# Altium schematic sheet schematic.SchDoc
size A4; SheetNumber: 1; SheetTotal: 5
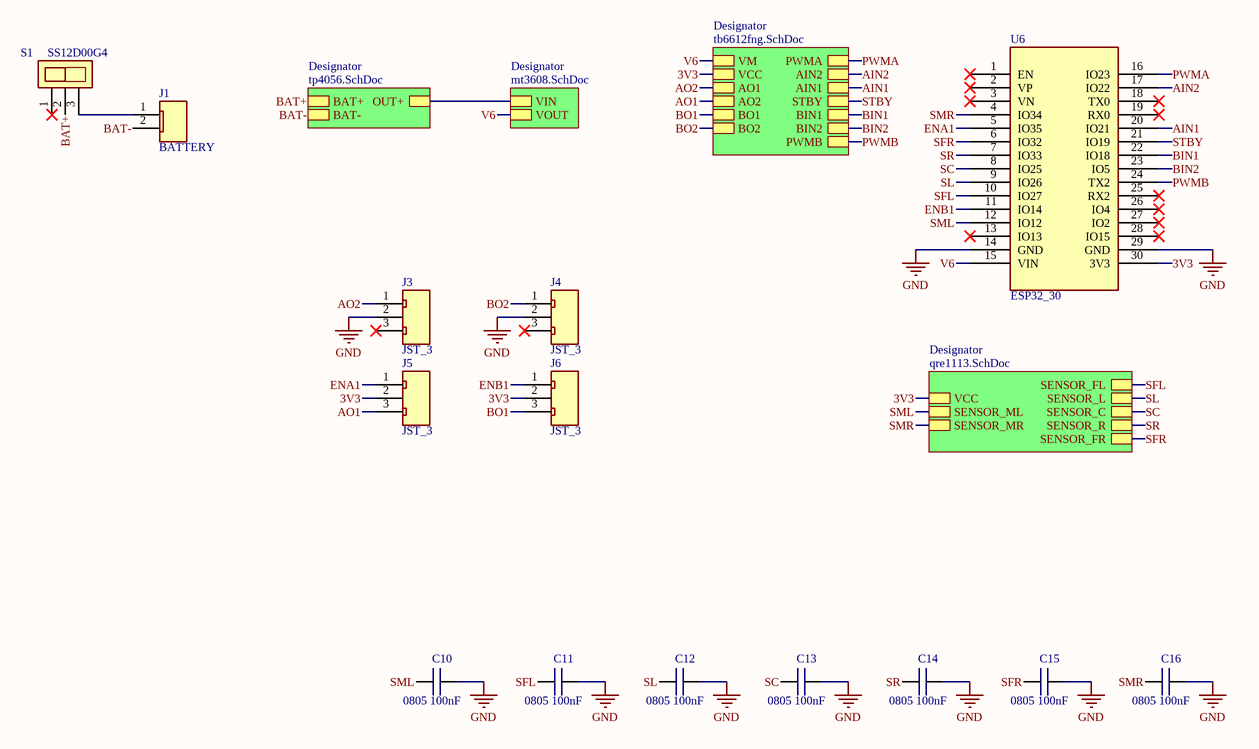
[diagram p0: schematic.SchDoc]

## Parts
C10  0805 100nF  [CAPACITOR 0805]
C11  0805 100nF  [CAPACITOR 0805]
C12  0805 100nF  [CAPACITOR 0805]
C13  0805 100nF  [CAPACITOR 0805]
C14  0805 100nF  [CAPACITOR 0805]
C15  0805 100nF  [CAPACITOR 0805]
C16  0805 100nF  [CAPACITOR 0805]
J1  BATTERY  [JST_2]
J3  JST_3  [JST_3]
J4  JST_3  [JST_3]
J5  JST_3  [JST_3]
J6  JST_3  [JST_3]
S1  SS12D00G4  [SS12D00G4]
U6  ESP32_30  [ESP32_30]

## Sub-sheets
Designator = mt3608.SchDoc: VIN, VOUT
Designator = tp4056.SchDoc: BAT+, OUT+, BAT-
Designator = tb6612fng.SchDoc: VM, VCC, AO1, AO2, BO1, BO2, PWMA, AIN2, AIN1, STBY, BIN1, BIN2, PWMB
Designator = qre1113.SchDoc: SENSOR_FL, SENSOR_L, SENSOR_R, SENSOR_C, SENSOR_FR, SENSOR_ML, SENSOR_MR, VCC

## Nets
GND: C10.2 C11.2 C12.2 C13.2 C14.2 C15.2 C16.2 J3.2 J4.2 U6.14(GND) U6.29(GND)
3V3: J5.2 J6.2 U6.30(3V3) ; sheet Designator/VCC, sheet Designator/VCC
AIN1: U6.20(IO21) ; sheet Designator/AIN1
AIN2: U6.17(IO22) ; sheet Designator/AIN2
AO1: J5.3 ; sheet Designator/AO2
AO2: J3.1 ; sheet Designator/AO1
BAT+: S1.2 ; sheet Designator/BAT+
BAT-: J1.2 ; sheet Designator/BAT-
BIN1: U6.22(IO18) ; sheet Designator/BIN1
BIN2: U6.23(IO5) ; sheet Designator/BIN2
BO1: J6.3 ; sheet Designator/BO1
BO2: J4.1 ; sheet Designator/BO2
ENA1: J5.1 U6.5(IO35)
ENB1: J6.1 U6.11(IO14)
PWMA: U6.16(IO23) ; sheet Designator/PWMA
PWMB: U6.24(TX2) ; sheet Designator/PWMB
SC: C13.1 U6.8(IO25) ; sheet Designator/SENSOR_C
SFL: C11.1 U6.10(IO27) ; sheet Designator/SENSOR_FL
SFR: C15.1 U6.6(IO32) ; sheet Designator/SENSOR_FR
SL: C12.1 U6.9(IO26) ; sheet Designator/SENSOR_L
SML: C10.1 U6.12(IO12) ; sheet Designator/SENSOR_ML
SMR: C16.1 U6.4(IO34) ; sheet Designator/SENSOR_MR
SR: C14.1 U6.7(IO33) ; sheet Designator/SENSOR_R
STBY: U6.21(IO19) ; sheet Designator/STBY
V6: U6.15(VIN) ; sheet Designator/VOUT, sheet Designator/VM
NetJ1_1: J1.1 S1.3
(unnamed): sheet Designator/VIN, sheet Designator/OUT+

Not connected (* = marked no-connect by the designer): J3 3*; J4 3*; S1 1*; U6 1(EN)* 2(VP)* 3(VN)* 13(IO13)* 18(TX0)* 19(RX0)* 25(RX2)* 26(IO4)* 27(IO2)* 28(IO15)*

## Library data of the parts
C10-C16 = CAPACITOR 0805
J1 = JST_2
U6 = ESP32_30: Microcontoller Board 30 Pins Wifi 2.4GHz BLE 4.2 ESP32-WROOM-32D; ComponentLink1Description: Datasheet; ComponentLink1URL: https://www.mouser.com/datasheet/2/891/esp32_wroom_32d_esp32_wroom_32u_datasheet_en-1365844.pdf